# EAGLE schematic H01R02 (EAGLE 9.6.2)

## Sheet 1 of 2
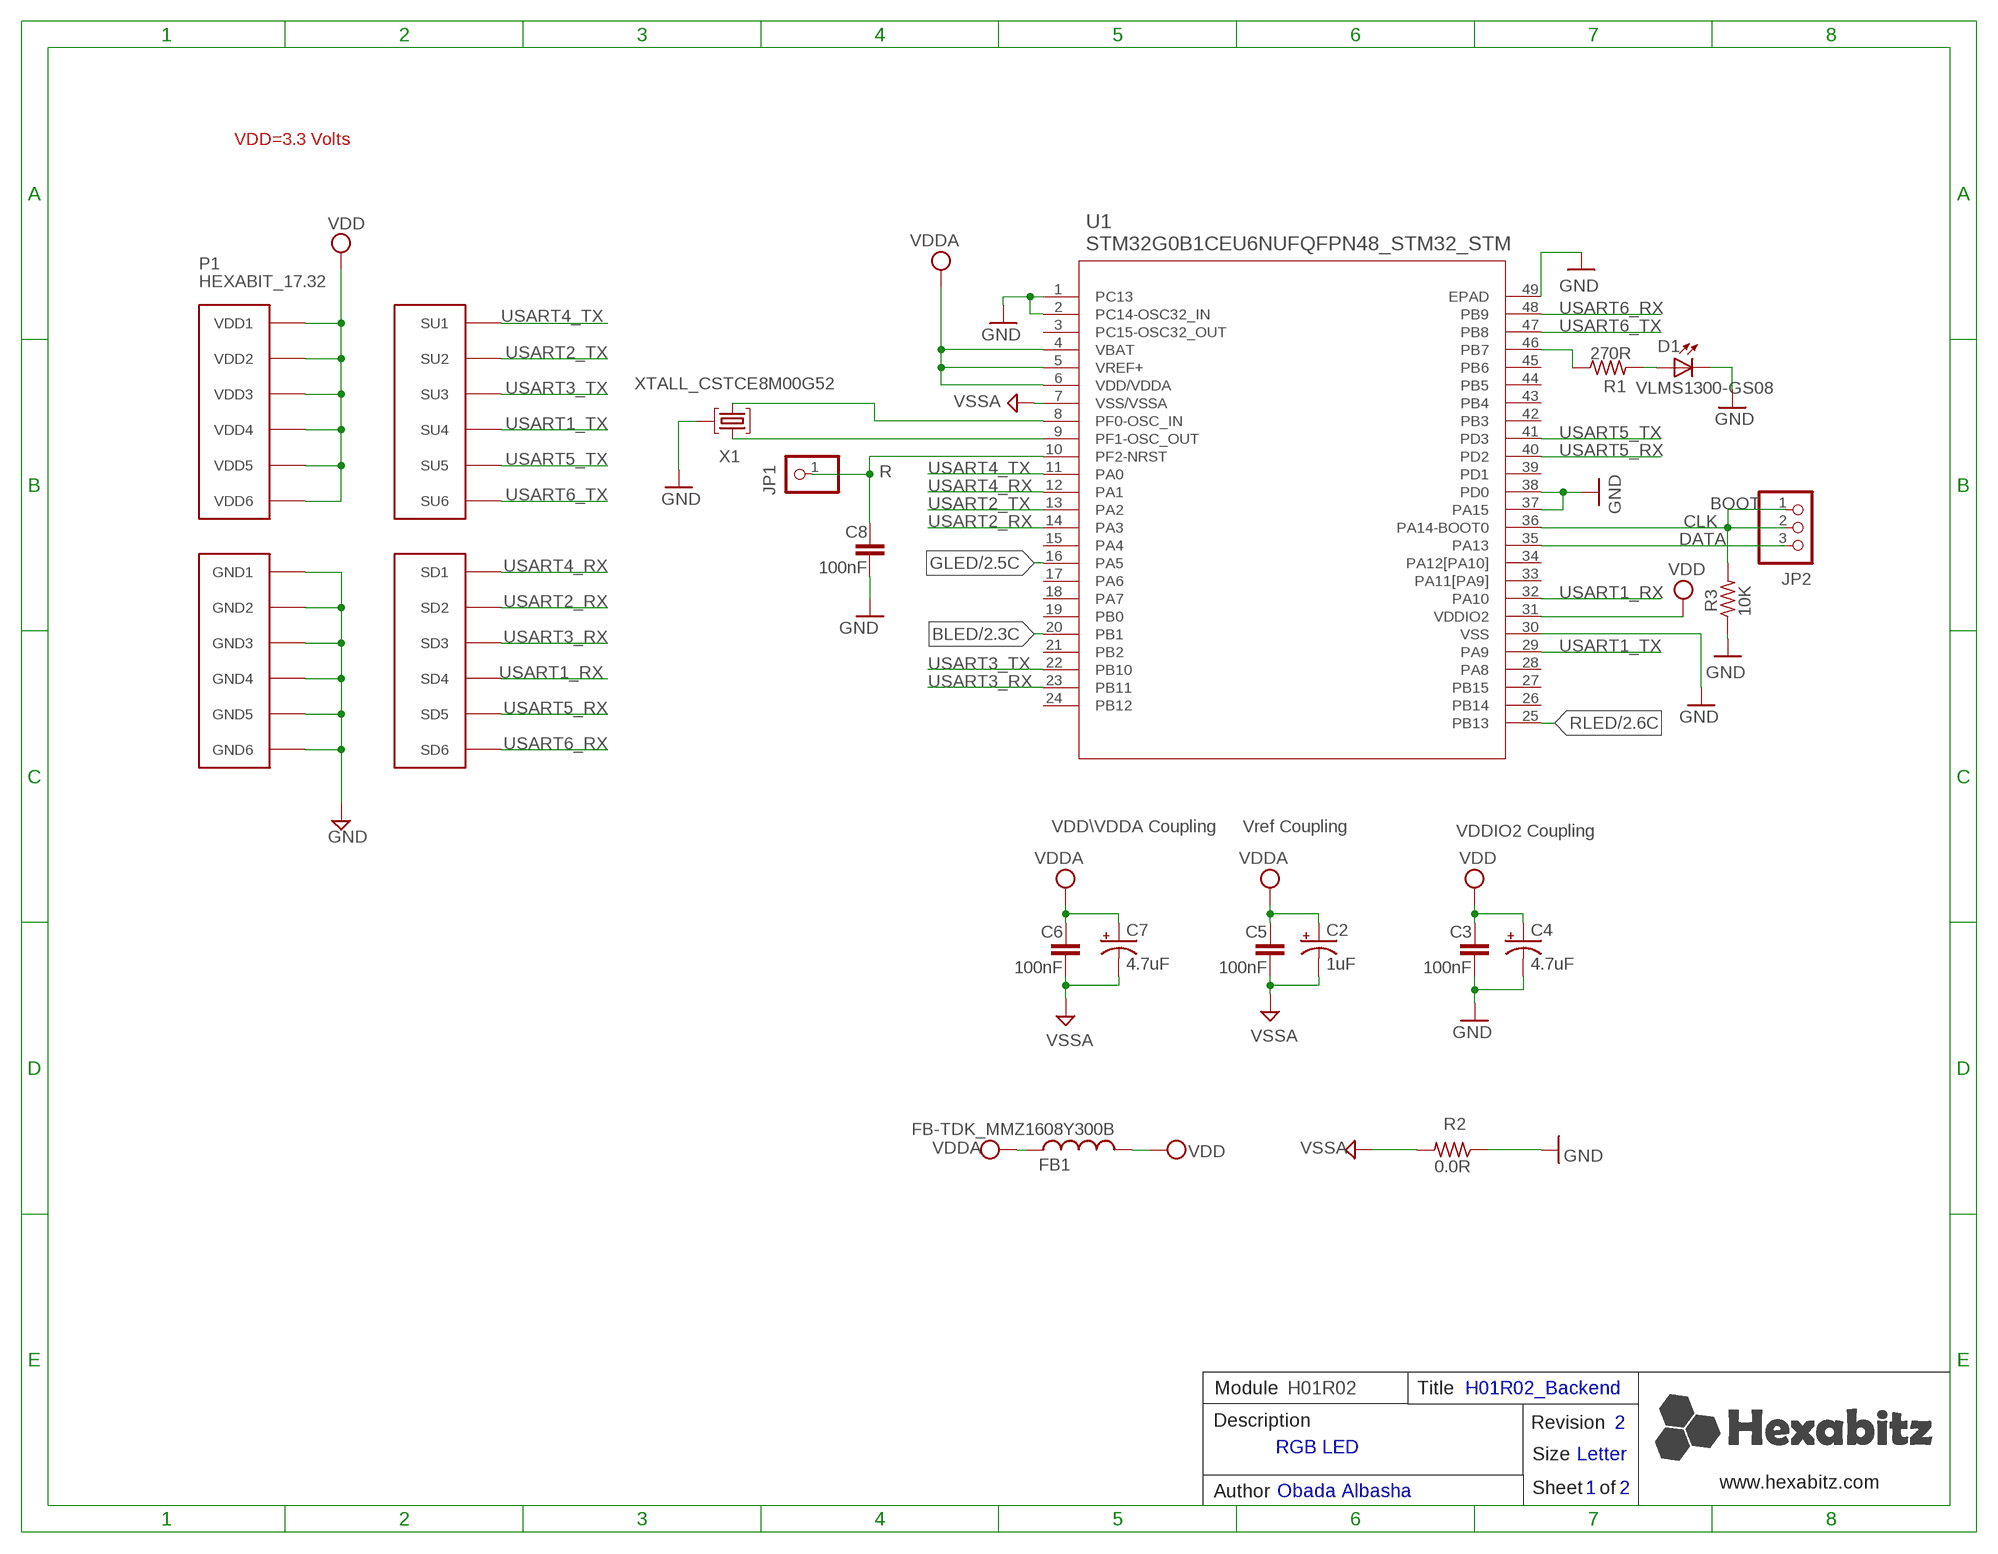
[diagram p0: schematic, sheet 1]

### Parts
C2  1uF  C-0805-POL  [C-0805-POL]
C3  100nF  C-0603  [C-0603]
C4  4.7uF  C-0805-POL  [C-0805-POL]
C5  100nF  C-0603  [C-0603]
C6  100nF  C-0603  [C-0603]
C7  4.7uF  C-0805-POL  [C-0805-POL]
C8  100nF  C-0603  [C-0603]
D1  VLMS1300-GS08  [VLMS1300-GS08]
FB1  FB-TDK_MMZ1608Y300B  [FB-TDK_MMZ1608Y300B]
JP1  R  PINHD-1X1  [1X01]
JP2  PINHD-1X3  [1X03]
P1  HEXABIT_17.32  [HEXABIT_17.32]
R1  270R  R-0603  [R-0603]
R2  0.0R  R-0603  [R-0603]
R3  10K  R-0603  [R-0603]
U1  STM32G0B1CEU6NUFQFPN48_STM32_STM  [UFQFPN48_STM32_STM]
X1  XTALL_CSTCE8M00G52  [XTALL_CSTCE8M00G52]

### Nets
BLED: U1.20(PB1) ; also sheet 2
CLK: JP2.1 JP2.2 R3.2 U1.36(PA14-BOOT0)
DATA: JP2.3 U1.35(PA13)
GLED: U1.16(PA5) ; also sheet 2
GND: C3.2 C4.2(-) C8.2 D1.C P1.PAD_PD7(GND1) P1.PAD_PD8(GND2) P1.PAD_PD9(GND3) P1.PAD_PD10(GND4) P1.PAD_PD11(GND5) P1.PAD_PD12(GND6) R2.1 R3.1 U1.1(PC13) U1.2(PC14-OSC32_IN) U1.30(VSS) U1.37(PA15) U1.38(PD0) U1.49(EPAD) X1.P$2 ; also sheet 2
N$3: D1.A R1.2
N$4: C8.1 JP1.1 U1.10(PF2-NRST)
N$5: U1.9(PF1-OSC_OUT) X1.P$1
N$6: U1.8(PF0-OSC_IN) X1.P$3
N$7: R1.1 U1.46(PB7)
RLED: U1.25(PB13) ; also sheet 2
USART1_RX: P1.PAD_PD4(SD4) U1.32(PA10)
USART1_TX: P1.PAD_PU4(SU4) U1.29(PA9)
USART2_RX: P1.PAD_PD2(SD2) U1.14(PA3)
USART2_TX: P1.PAD_PU2(SU2) U1.13(PA2)
USART3_RX: P1.PAD_PD3(SD3) U1.23(PB11)
USART3_TX: P1.PAD_PU3(SU3) U1.22(PB10)
USART4_RX: P1.PAD_PD1(SD1) U1.12(PA1)
USART4_TX: P1.PAD_PU1(SU1) U1.11(PA0)
USART5_RX: P1.PAD_PD5(SD5) U1.40(PD2)
USART5_TX: P1.PAD_PU5(SU5) U1.41(PD3)
USART6_RX: P1.PAD_PD6(SD6) U1.48(PB9)
USART6_TX: P1.PAD_PU6(SU6) U1.47(PB8)
VDD: C3.1 C4.1(+) FB1.2 P1.PAD_PU7(VDD1) P1.PAD_PU8(VDD2) P1.PAD_PU9(VDD3) P1.PAD_PU10(VDD4) P1.PAD_PU11(VDD5) P1.PAD_PU12(VDD6) U1.31(VDDIO2) ; also sheet 2
VDDA: C2.1(+) C5.1 C6.1 C7.1(+) FB1.1 U1.4(VBAT) U1.5(VREF+) U1.6(VDD/VDDA)
VSSA: C2.2(-) C5.2 C6.2 C7.2(-) R2.2 U1.7(VSS/VSSA)
Unconnected: U1.3(PC15-OSC32_OUT) U1.15(PA4) U1.17(PA6) U1.18(PA7) U1.19(PB0) U1.21(PB2) U1.24(PB12) U1.26(PB14) U1.27(PB15) U1.28(PA8) U1.33(PA11[PA9]) U1.34(PA12[PA10]) U1.39(PD1) U1.42(PB3) U1.43(PB4) U1.44(PB5) U1.45(PB6)

### Notes on the sheet
- VDD=3.3 Volts
- BOOT
- VDD\VDDA Coupling | Vref Coupling | VDDIO2 Coupling
- Module | H01R02 | Title | H01R02_Backend
- Description | Revision | 2
- RGB LED
- Size | Letter
- www.hexabitz.com
- Author | Obada Albasha | Sheet   of | 1 | 2
- C:/Users/Admin/Desktop/logodraft.bmp

## Sheet 2 of 2
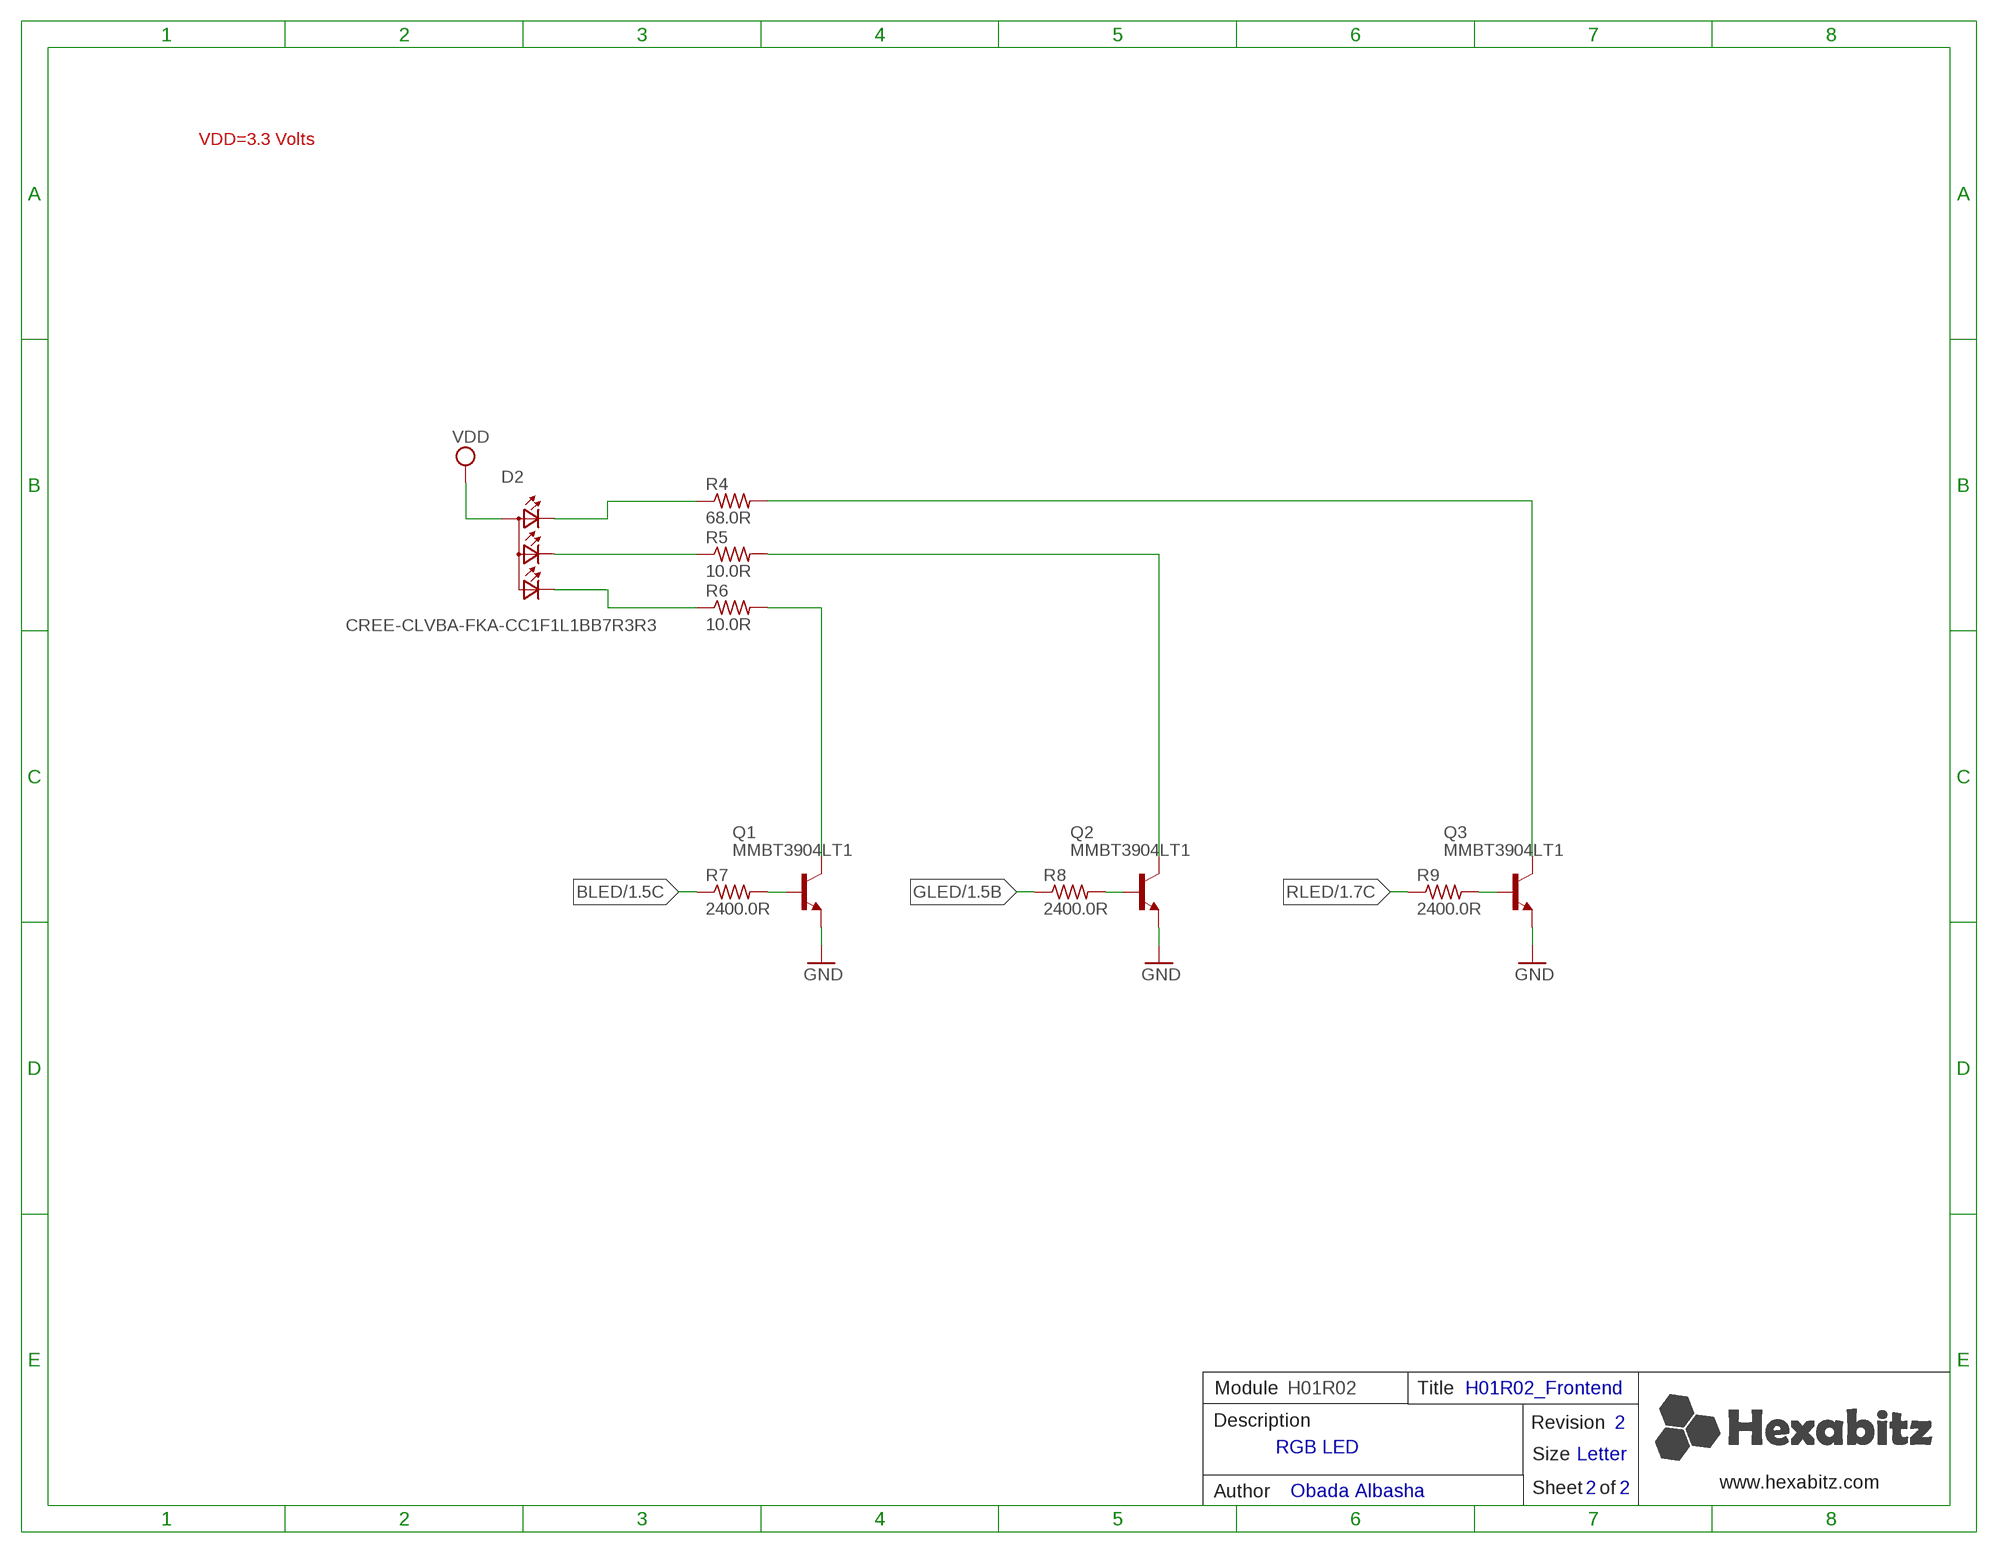
[diagram p1: schematic, sheet 2]

### Parts
D2  CREE-CLVBA-FKA-CC1F1L1BB7R3R3  [PCB-1023943-1]
Q1  MMBT3904LT1  [MMBT3904LT1]
Q2  MMBT3904LT1  [MMBT3904LT1]
Q3  MMBT3904LT1  [MMBT3904LT1]
R4  68.0R  R-0603  [R-0603]
R5  10.0R  R-0603  [R-0603]
R6  10.0R  R-0603  [R-0603]
R7  2400.0R  R-0603  [R-0603]
R8  2400.0R  R-0603  [R-0603]
R9  2400.0R  R-0603  [R-0603]

### Nets
BLED: R7.1 ; also sheet 1
GLED: R8.1 ; also sheet 1
GND: Q1.2(E) Q2.2(E) Q3.2(E) ; also sheet 1
N$1: D2.P$1(CRED) R4.1
N$2: D2.P$4(CGREEN) R5.1
N$8: D2.P$3(CBLUE) R6.1
N$10: Q1.3(C) R6.2
N$11: Q2.3(C) R5.2
N$12: Q3.3(C) R4.2
N$13: Q1.1(B) R7.2
N$14: Q2.1(B) R8.2
N$15: Q3.1(B) R9.2
RLED: R9.1 ; also sheet 1
VDD: D2.P$2(A2) ; also sheet 1

### Notes on the sheet
- VDD=3.3 Volts
- Module | H01R02 | Title | H01R02_Frontend
- Description | Revision | 2
- RGB LED
- Size | Letter
- www.hexabitz.com
- Author | Obada Albasha | Sheet   of | 2 | 2

## Library data of the parts
C2 C4 C7 = HEXABITZ_RCLS:C-0805-POL: Cap Tant Solid SMD 2012
C3 C5 C6 C8 = HEXABITZ_RCLS:C-0603: CAP CER 10% X7R 0603
D1 = Hexabitz:VLMS1300-GS08: Red 0603 130° Clear 54 mcd 2 V Surface Mount ChipLED ; Octopart Url : http://octopart.com/vlms1300-gs08-vishay-21709201; MFN: Vishay; MPN: VLMS1300-GS08; OCTOPART_URL: https://octopart.com/vlms1300-gs08-vishay-21709201?r=sp&s=_gcP4_q8T1SC6PJQPTQ9yA
D2 = Hexabitz:CREE-CLVBA-FKA-CC1F1L1BB7R3R3: Description: CREE CLVBA-FKA-CC1F1L1BB7R3R3 LED, HB, RGB, SMD, 130mW ; Parameter : Lens Color/Style : UV Tinted, Luminous Intensity : 112 mcd, 224 mcd, 56 mcd, Manufacturer : Cree, Inc. , Manufacturer Part Number : CLVBA-FKA-CC1F1L1BB7R3R3, Maximum Operating Temperature : +100 C, Minimum Operating Temperature : -40C, Number of Pins : 4, Octopart Url : https://octopart.com/clvba-fka-cc1f1l1bb7r3r3-cree-20054005, OctopartID : 27a4ef9ffd37f863, Package / Case : PLCC-4, Packaging : Reel, Product Category : Standard LEDs - SMD, RoHS : Compliant, Viewing Angle : 110*, Wavelength/Color Temperature : 630 nm, 527 nm, 470 nm; MFN: Cree, Inc.; MPN: CLVBA-FKA-CC1F1L1BB7R3R3; OCTOPART_URL: https://octopart.com/clvba-fka-cc1f1l1bb7r3r3-cree-20054005
FB1 = HEXABITZ_RCLS:FB-TDK_MMZ1608Y300B: Ferrite Beads Multi-Layer 30Ohm 25% 100MHz 1.5A 50mOhm DCR 0603; MFN: TDK; MPN: MMZ1608Y300B; OCTOPART_URL: https://octopart.com/mmz1608y300b-tdk-368280?r=sp&s=cd9_2ZEqQ9q9UNBuQgHAiA
JP1 = HEXABITZ_USER_INTERFACE_PARTS:PINHD-1X1: PIN HEADER; MFN: TE Connectivity; MPN: 87227-1; OCTOPART_URL: https://octopart.com/87227-1-te+connectivity-39512052?r=sp
JP2 = pinhead:PINHD-1X3: PIN HEADER
P1 = hexabitz_connectors:HEXABIT_?: Hexabitz Hexagon Module Connector Hexagon side length = 17.32mm.
Q1 = HEXABITZ_RCLS:MMBT3904LT1: TRANS NPN 40V 0.2A SOT23; MFN: ON Semiconductor; MOUNTING_STYLE: Surface Mount; MPN: MMBT3904LT1G; NUM_OF_PINS: 3; OCTOPART_ID: 0bb6c2bc2200d471; OCTOPART_URL: http://octopart.com/mmbt3904lt1g-on+semiconductor-3280; PACKAGE: SOT-23-3; PACKAGING: Reel; POLARITY: NPN; POWER_DISSIPATION: 0.225W; PRODUCT_CATEGORY: Transistors Bipolar-BJT; SERIES: MMBT3904L; VOLTAGE_RATING_DC: 40.0V
Q2 Q3 = HEXABITZ_RCLS:MMBT3904LT1: TRANS NPN 40V 0.2A SOT23; MOUNTING_STYLE: Surface Mount; NUM_OF_PINS: 3; OCTOPART_ID: 0bb6c2bc2200d471; OCTOPART_URL: http://octopart.com/mmbt3904lt1g-on+semiconductor-3280; PACKAGE: SOT-23-3; PACKAGING: Reel; POLARITY: NPN; POWER_DISSIPATION: 0.225W; PRODUCT_CATEGORY: Transistors Bipolar-BJT; SERIES: MMBT3904L; VOLTAGE_RATING_DC: 40.0V
R1 R3 = HEXABITZ_RCLS:R-0603: Thick Film Resistors - SMD 0603
R2 = HEXABITZ_RCLS:R-0603: Thick Film Resistors - SMD 0603; MFN: Yageo; MPN: RC0603JR-070RL; OCTOPART_URL: https://octopart.com/rc0603jr-070rl-yageo-1241539?r=sp&s=X2NteqRjRNWrnx42Y0aliA; RESISTANCE: 0.0 Ohm
R4 = HEXABITZ_RCLS:R-0603: Thick Film Resistors - SMD 0603; MFN: Vishay; MPN: CRCW060368R0FKEA; OCTOPART_URL: https://octopart.com/crcw060368r0fkea-vishay-39811903; RESISTANCE: 68.0 Ω; SPICEPREFIX: R; TOLERANCE: 1%
R5 R6 = HEXABITZ_RCLS:R-0603: Thick Film Resistors - SMD 0603; MFN: Vishay; MPN: CRCW060310R0FKEB; OCTOPART_URL: https://octopart.com/crcw060310r0fkeb-vishay-42507905; RESISTANCE: 10.0 Ω; TOLERANCE: 1%
R7-R9 = HEXABITZ_RCLS:R-0603: Thick Film Resistors - SMD 0603; MFN: Vishay; MPN: CRCW06032K40JNEA; OCTOPART_URL: https://octopart.com/crcw06032k40jnea-vishay-40298967; RESISTANCE: 2400.0 Ω; TOLERANCE: 5%
U1 = HEXABITZ_ICs:STM32G0B1CEU6N; COPYRIGHT: Copyright (C) 2022 Ultra Librarian. All rights reserved.; MFN: STMicroelectronics; MPN: STM32G0B1CEU6N; OCTOPART_URL: https://app.ultralibrarian.com/details/c038d58b-752a-11eb-9033-0a34d6323d74/STMicroelectronics/STM32G0B1CEU6N?uid=116364672
X1 = Hexabitz:XTALL_CSTCE8M00G52: MURATA CSTCE8M00G52-R0 RESONATOR, SMD, 8MHZ ; Octopart Url : https://octopart.com/cstce8m00g52-r0-murata-7145559; MFN: Murata; MPN: CSTCE8M00G52Z-R0; OCTOPART_URL: https://octopart.com/cstce8m00g52z-r0-murata-17755941?r=sp&s=JDnNJnrHQhyS8Zk4ofFWXw